# Altium project Desk-Clock-Timer.PrjPcb
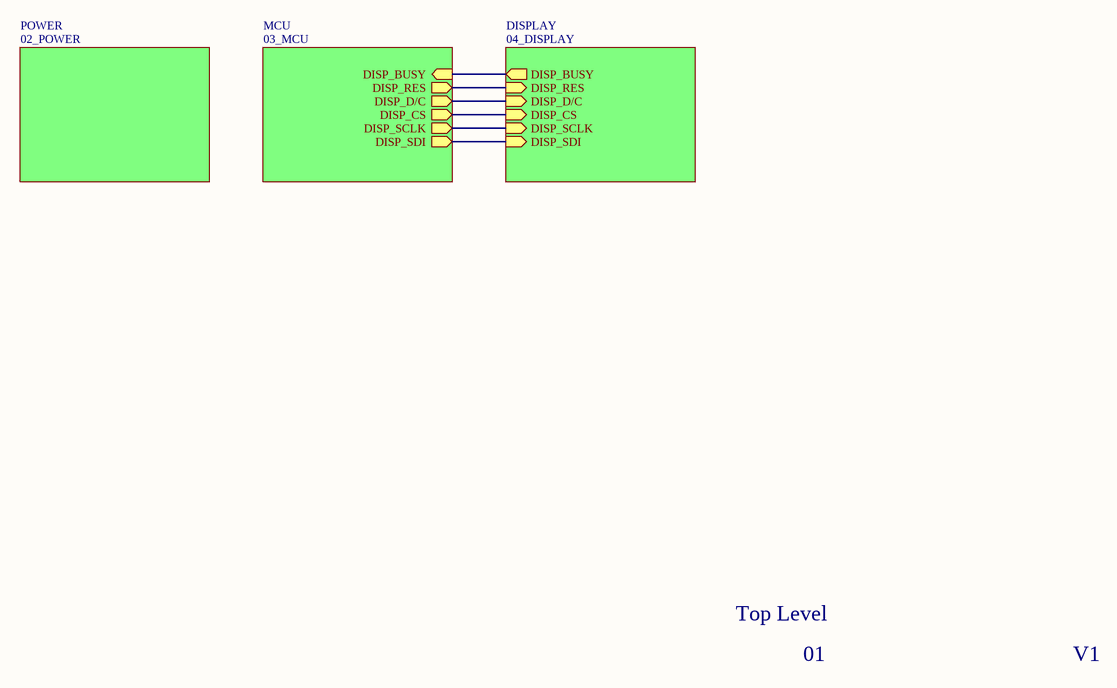
[diagram p0: 01_TOP_LEVEL.SchDoc]
4 sheets, 87 parts. Net scope: hierarchical (ports join the sheet entries above them; power ports are global).
Board file: PCB1.PcbDoc
Sheets:
  01_TOP_LEVEL.SchDoc
    POWER = 02_POWER.SchDoc
    MCU = 03_MCU.SchDoc
    DISPLAY = 04_DISPLAY.SchDoc

## Sheet 01_TOP_LEVEL.SchDoc
size A4; SheetNumber: 1; SheetTotal: 4

### Sub-sheets
DISPLAY = 04_DISPLAY: DISP_BUSY (out), DISP_RES (in), DISP_D/C (in), DISP_CS (in), DISP_SCLK (in), DISP_SDI (in)
MCU = 03_MCU: DISP_BUSY (in), DISP_RES (out), DISP_D/C (out), DISP_CS (out), DISP_SCLK (out), DISP_SDI (out)
POWER = 02_POWER: no entries

### Nets
NetIC300_13: sheet MCU/DISP_CS, sheet DISPLAY/DISP_CS
NetIC300_14: sheet MCU/DISP_SCLK, sheet DISPLAY/DISP_SCLK
NetIC300_15: sheet MCU/DISP_D/C, sheet DISPLAY/DISP_D/C
NetIC300_16: sheet MCU/DISP_SDI, sheet DISPLAY/DISP_SDI
NetIC300_17: sheet MCU/DISP_RES, sheet DISPLAY/DISP_RES
NetIC300_18: sheet MCU/DISP_BUSY, sheet DISPLAY/DISP_BUSY

### Notes on the sheet
- Top Level
- 01
- V1

## Sheet 02_POWER.SchDoc
size A4; SheetNumber: 2; SheetTotal: 4
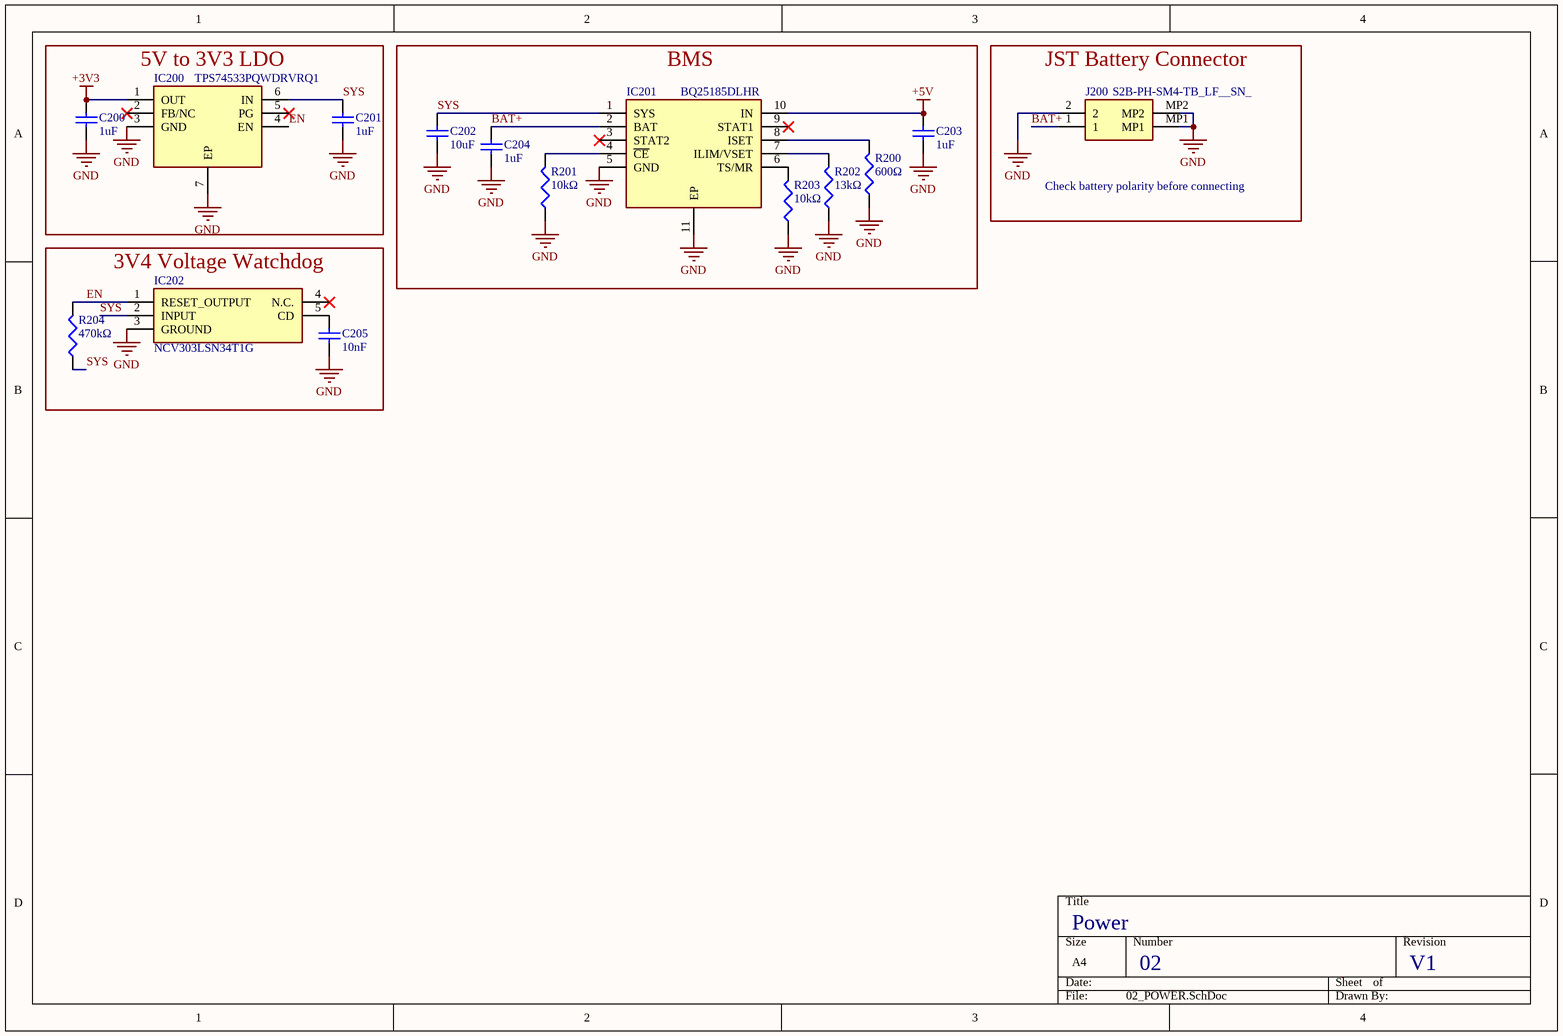
[diagram p1: 02_POWER.SchDoc]

### Parts
C200  value 1uF  [CAPC1005X55X25LL05T10]  (hidden comment: Capacitor 1 uF +/- 10% 6.3 V 0402)
C201  value 1uF  [CAPC1005X55X25LL05T10]  (hidden comment: Capacitor 1 uF +/- 10% 6.3 V 0402)
C202  value 10uF  [CAPC1005X55X25LL05T10]  (hidden comment: Capacitor 1 uF +/- 10% 6.3 V 0402)
C203  value 1uF  [CAPC1005X55X25LL05T10]  (hidden comment: Capacitor 1 uF +/- 10% 6.3 V 0402)
C204  value 1uF  [CAPC1005X55X25LL05T10]  (hidden comment: Capacitor 1 uF +/- 10% 6.3 V 0402)
C205  value 10nF  [CAPC1005X55X25LL05T10]  (hidden comment: Capacitor 1 uF +/- 10% 6.3 V 0402)
IC200  TPS74533PQWDRVRQ1  [SON65P200X200X80-7N]
IC201  BQ25185DLHR  [SON40P220X200X80-11N]
IC202  NCV303LSN34T1G  [SOT95P275X110-5N]
J200  S2B-PH-SM4-TB_LF__SN_  [S2BPHSM4TBLFSN]
R200  value 600Ω  [RESC0402(1005)_L]  (hidden comment: 100R2F)
R201  value 10kΩ  [RESC0402(1005)_L]  (hidden comment: 100R2F)
R202  value 13kΩ  [RESC0402(1005)_L]  (hidden comment: 100R2F)
R203  value 10kΩ  [RESC0402(1005)_L]  (hidden comment: 100R2F)
R204  value 470kΩ  [RESC0402(1005)_L]  (hidden comment: 100R2F)

### Blocks framed on the sheet
5V to 3V3 LDO: C200 C201 IC200
BMS: C202-C204 IC201 R200-R203
JST Battery Connector: J200
3V4 Voltage Watchdog: C205 IC202 R204

### Nets
+3V3: C200.2 IC200.1(OUT)
+5V: C203.2 IC201.10(IN)
GND: C200.1 C201.1 C202.1 C203.1 C204.1 C205.1 IC200.3(GND) IC200.7(EP) IC201.5(GND) IC201.11(EP) IC202.3(GROUND) J200.2 J200.MP1 J200.MP2 R200.1 R201.1 R202.1 R203.1
BAT+: C204.2 IC201.2(BAT) J200.1
EN: IC200.4(EN) IC202.1(RESET_OUTPUT) R204.2
SYS: C201.2 C202.2 IC200.6(IN) IC201.1(SYS) IC202.2(INPUT) R204.1
NetC205_2: C205.2 IC202.5(CD)
NetIC201_4: IC201.4(~{CE}) R201.2
NetIC201_6: IC201.6(TS/MR) R203.2
NetIC201_7: IC201.7(ILIM/VSET) R202.2
NetIC201_8: IC201.8(ISET) R200.2

Not connected (* = marked no-connect by the designer): IC200 2(FB/NC)* 5(PG)*; IC201 3(STAT2)* 9(STAT1)*; IC202 4(N.C.)*

### Notes on the sheet
- Check battery polarity before connecting
- Power
- 02
- V1

### Library data of the parts
C200-C205 = CMP-001-00008-6: Chip Capacitor, 1 uF, +/- 10%, 6.3 V, 0402 (1005 Metric); Capacitor Type: Ceramic; Voltage Rating: 6.3V; Max Operating Temperature: 85°C; Mounting Technology: SM; Tolerance: 10%; Case/Package: 0402; RoHS Compliant: True; Min Operating Temperature: -55°C; Pins: 2
IC200 = TPS74533PQWDRVRQ1: Integrated Circuit; Manufacturer_Name: Texas Instruments; Datasheet Link: https://www.ti.com/lit/gpn/TPS745-Q1; Height: 0.8mm; Manufacturer_Part_Number: TPS74533PQWDRVRQ1; Mouser Part Number: 595-PS74533PQWDRVRQ1; Mouser Price/Stock: https://www.mouser.co.uk/ProductDetail/Texas-Instruments/TPS74533PQWDRVRQ1?qs=%252B6g0mu59x7KMjoigNjBCww%3D%3D
IC201 = BQ25185DLHR: Integrated Circuit; Manufacturer_Name: Texas Instruments; Datasheet Link: https://www.ti.com/lit/ds/symlink/bq25185.pdf?ts=1706857561339&ref_url=https%253A%252F%252Fwww.ti.com%252Fproduct%252FBQ25185; Height: 0.8mm; Manufacturer_Part_Number: BQ25185DLHR; Mouser Part Number: 595-BQ25185DLHR; Mouser Price/Stock: https://www.mouser.co.uk/ProductDetail/Texas-Instruments/BQ25185DLHR?qs=Z%252BL2brAPG1IbO%2FV3RqsaPw%3D%3D
IC202 = NCV303LSN34T1G: Integrated Circuit; Manufacturer_Name: onsemi; Datasheet Link: https://www.onsemi.com/pub/Collateral/NCP302-D.PDF; Height: 1.1mm; Manufacturer_Part_Number: NCV303LSN34T1G; Mouser Part Number: 863-NCV303LSN34T1G; Mouser Price/Stock: https://www.mouser.com/Search/Refine.aspx?Keyword=863-NCV303LSN34T1G; Arrow Part Number: NCV303LSN34T1G; Arrow Price/Stock: https://www.arrow.com/en/products/ncv303lsn34t1g/on-semiconductor.html?utm_currency=USD&region=europe
J200 = S2B-PH-SM4-TB_LF__SN_: Connector; Manufacturer_Name: JST (JAPAN SOLDERLESS TERMINALS); Manufacturer_Part_Number: S2B-PH-SM4-TB(LF)(SN); Datasheet Link: https://www.jst-mfg.com/product/pdf/eng/ePH.pdf; Height: 6.6mm; Mouser Part Number: N/A; Mouser Price/Stock: https://www.mouser.co.uk/ProductDetail/JST-Commercial/S2B-PH-SM4-TBLFSN?qs=QpmGXVUTftEA9IU90i0xlg%3D%3D; Arrow Part Number: S2B-PH-SM4-TB(LF)(SN); Arrow Price/Stock: https://www.arrow.com/en/products/s2b-ph-sm4-tb-lf-sn/jst-manufacturing?utm_currency=USD&region=europe; ComponentLink1Description: DigiKey; ComponentLink1URL: https://www.digikey.ca/en/products/detail/jst-sales-america-inc/S2B-PH-SM4-TB/926655; ComponentLink2Description: Battery; ComponentLink2URL: https://www.amazon.ca/4200mah-Rechargeable-Lithium-Replacement-Electronic/dp/B091Y3TW9F?sr=8-6
R200-R204 = CMP-009-00065-2: 100R 0.063W 1% 0402 (1005 Metric)  SMD; Power: 63mW; Tolerance: 1%; Case/Package: 0402; Pins: 2; Mounting Technology: SMT

## Sheet 03_MCU.SchDoc
size A3; SheetNumber: 3; SheetTotal: 4
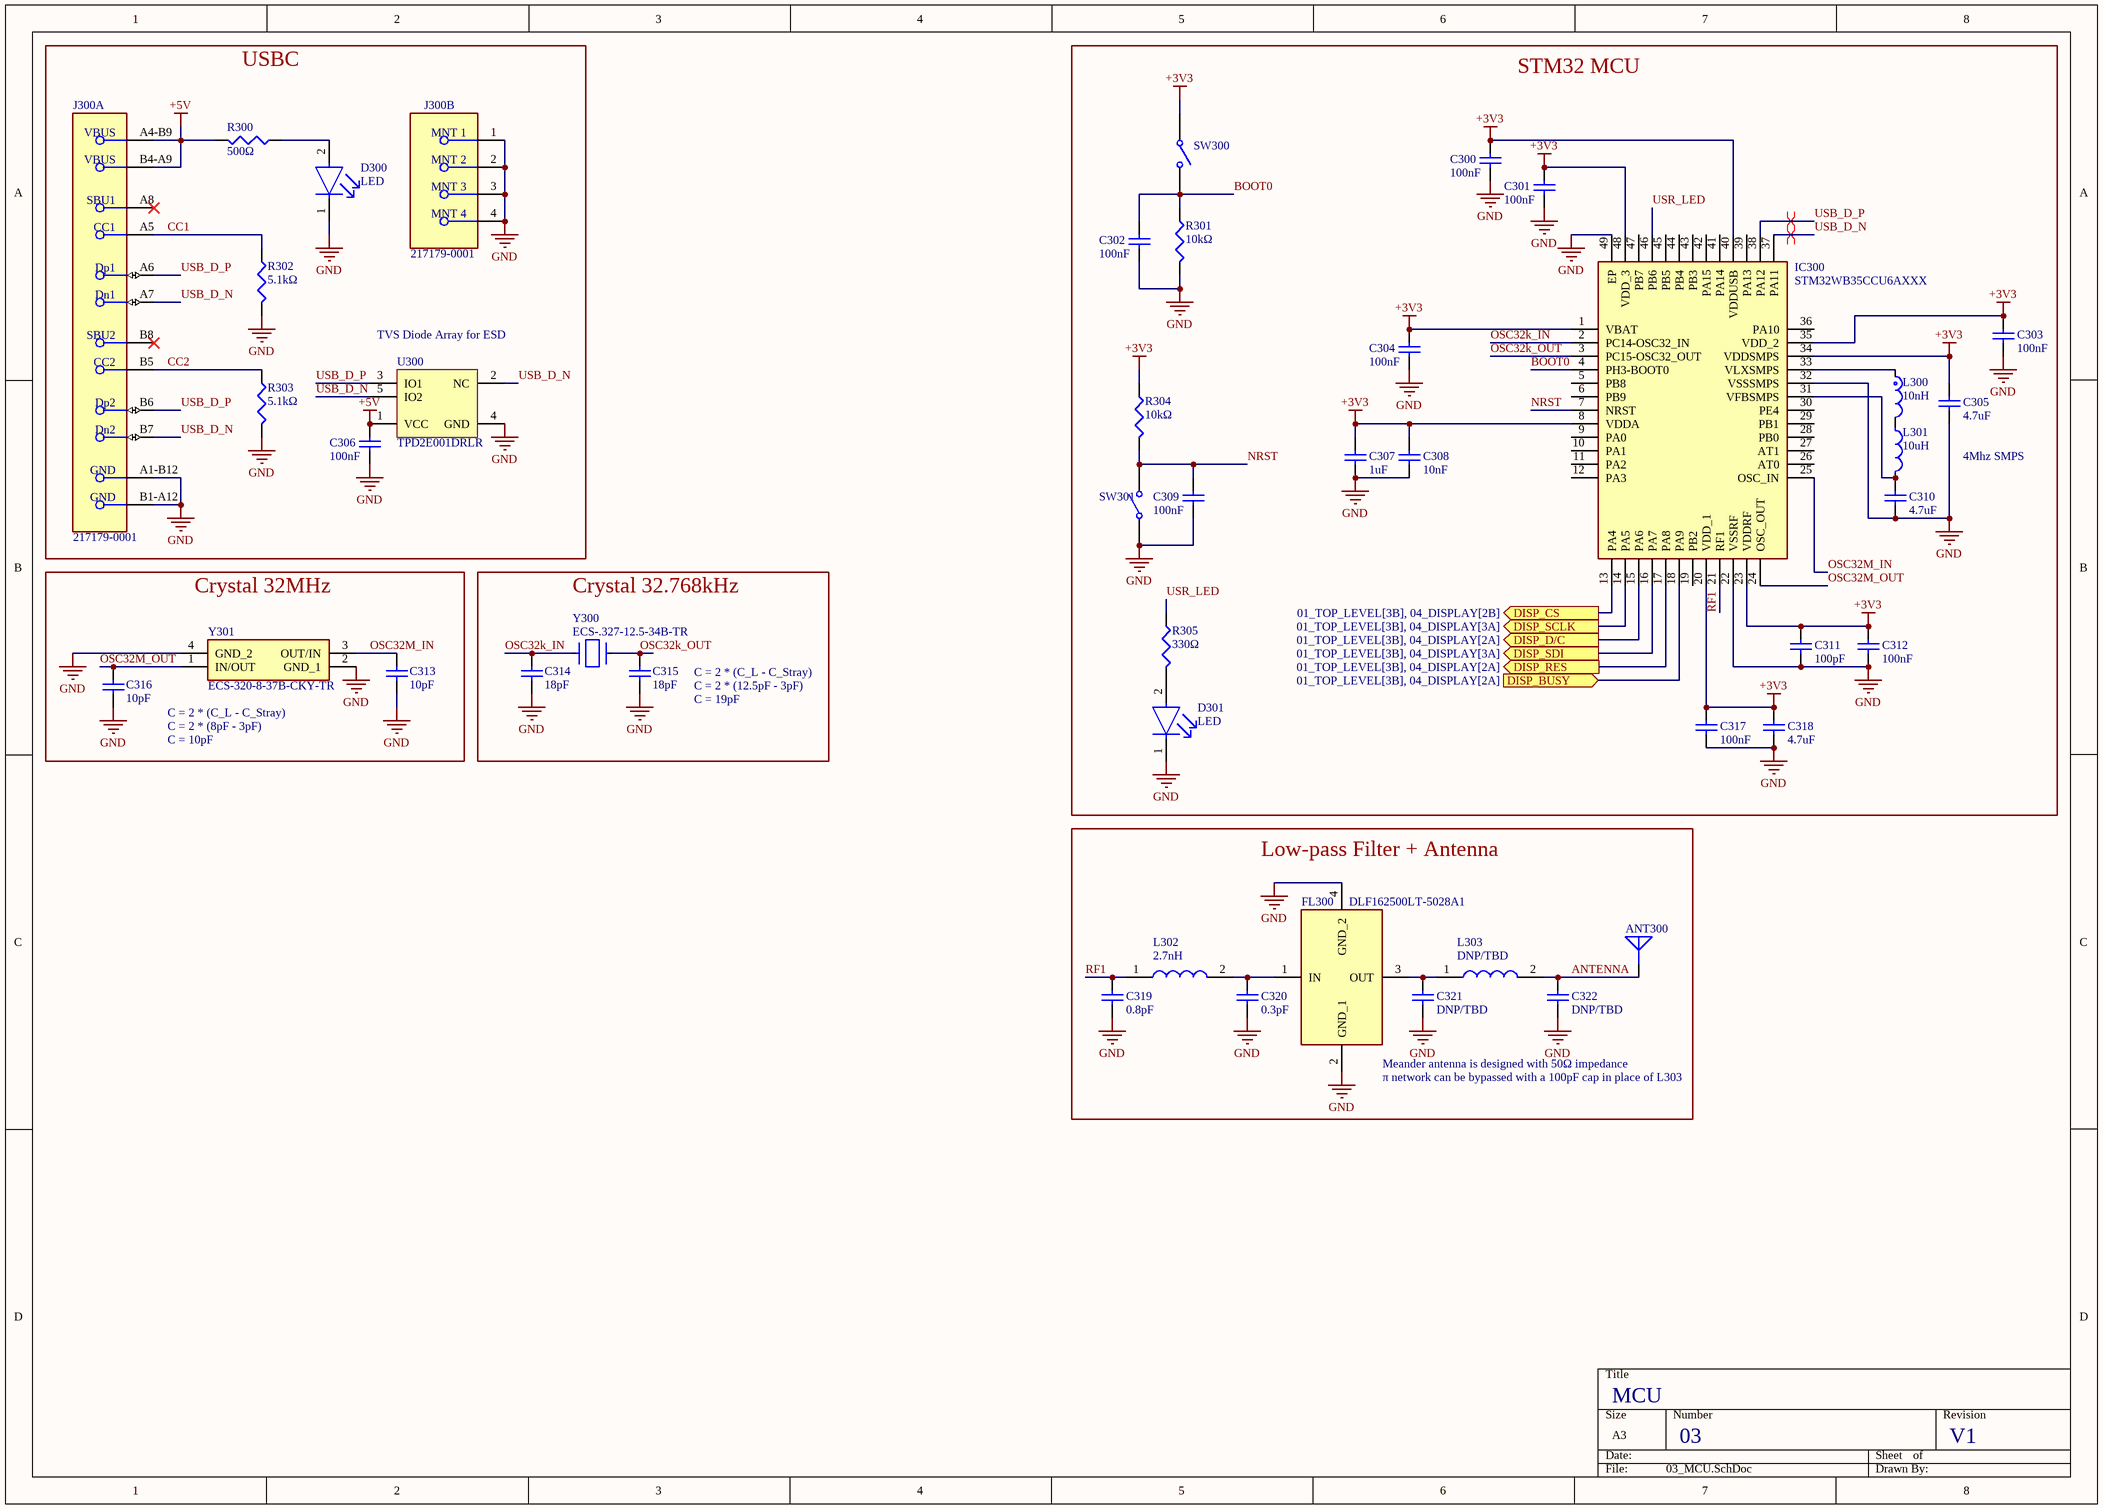
[diagram p2: 03_MCU.SchDoc]

### Parts
ANT300  MEANDER_ANTENNA  [MEANDER_ANTENNA]  (value not drawn)
C300  value 100nF  [CAPC1005X55X25LL05T10]  (hidden comment: Capacitor 1 uF +/- 10% 6.3 V 0402)
C301  value 100nF  [CAPC1005X55X25LL05T10]  (hidden comment: Capacitor 1 uF +/- 10% 6.3 V 0402)
C302  value 100nF  [CAPC1005X55X25LL05T10]  (hidden comment: Capacitor 1 uF +/- 10% 6.3 V 0402)
C303  value 100nF  [CAPC1005X55X25LL05T10]  (hidden comment: Capacitor 1 uF +/- 10% 6.3 V 0402)
C304  value 100nF  [CAPC1005X55X25LL05T10]  (hidden comment: Capacitor 1 uF +/- 10% 6.3 V 0402)
C305  value 4.7uF  [CAPC1005X55X25LL05T10]  (hidden comment: Capacitor 1 uF +/- 10% 6.3 V 0402)
C306  value 100nF  [CAPC1005X55X25LL05T10]  (hidden comment: Capacitor 1 uF +/- 10% 6.3 V 0402)
C307  value 1uF  [CAPC1005X55X25LL05T10]  (hidden comment: Capacitor 1 uF +/- 10% 6.3 V 0402)
C308  value 10nF  [CAPC1005X55X25LL05T10]  (hidden comment: Capacitor 1 uF +/- 10% 6.3 V 0402)
C309  value 100nF  [CAPC1005X55X25LL05T10]  (hidden comment: Capacitor 1 uF +/- 10% 6.3 V 0402)
C310  value 4.7uF  [CAPC1005X55X25LL05T10]  (hidden comment: Capacitor 1 uF +/- 10% 6.3 V 0402)
C311  value 100pF  [CAPC1005X55X25LL05T10]  (hidden comment: Capacitor 1 uF +/- 10% 6.3 V 0402)
C312  value 100nF  [CAPC1005X55X25LL05T10]  (hidden comment: Capacitor 1 uF +/- 10% 6.3 V 0402)
C313  value 10pF  [CAPC1005X55X25LL05T10]  (hidden comment: Capacitor 1 uF +/- 10% 6.3 V 0402)
C314  value 18pF  [CAPC1005X55X25LL05T10]  (hidden comment: Capacitor 1 uF +/- 10% 6.3 V 0402)
C315  value 18pF  [CAPC1005X55X25LL05T10]  (hidden comment: Capacitor 1 uF +/- 10% 6.3 V 0402)
C316  value 10pF  [CAPC1005X55X25LL05T10]  (hidden comment: Capacitor 1 uF +/- 10% 6.3 V 0402)
C317  value 100nF  [CAPC1005X55X25LL05T10]  (hidden comment: Capacitor 1 uF +/- 10% 6.3 V 0402)
C318  value 4.7uF  [CAPC1005X55X25LL05T10]  (hidden comment: Capacitor 1 uF +/- 10% 6.3 V 0402)
C319  value 0.8pF  [CAPC1005X55X25LL05T10]  (hidden comment: Capacitor 1 uF +/- 10% 6.3 V 0402)
C320  value 0.3pF  [CAPC1005X55X25LL05T10]  (hidden comment: Capacitor 1 uF +/- 10% 6.3 V 0402)
C321  value DNP/TBD  [CAPC1005X55X25LL05T10]  (hidden comment: Capacitor 1 uF +/- 10% 6.3 V 0402)
C322  value DNP/TBD  [CAPC1005X55X25LL05T10]  (hidden comment: Capacitor 1 uF +/- 10% 6.3 V 0402)
D300  LED  [FP-VLMO1500-GS08-MFG]
D301  LED  [FP-VLMO1500-GS08-MFG]
FL300  DLF162500LT-5028A1  [DLF162500LT5028A1]
IC300  STM32WB35CCU6AXXX  [QFN50P700X700X65-49N-D]
J300  217179-0001  [FP-2171790001-MFG]  (parts A,B of 2)
L300  10nH  [FP-LQG15WH_02-MFG]
L301  10uH  [FP-LQM21FN_70-MFG]
L302  2.7nH  [LQG15WH0N7B02D]
L303  DNP/TBD  [LQG15WH0N7B02D]
R300  value 500Ω  [RESC0402(1005)_L]  (hidden comment: 100R2F)
R301  value 10kΩ  [RESC0402(1005)_L]  (hidden comment: 100R2F)
R302  value 5.1kΩ  [RESC0402(1005)_L]  (hidden comment: 100R2F)
R303  value 5.1kΩ  [RESC0402(1005)_L]  (hidden comment: 100R2F)
R304  value 10kΩ  [RESC0402(1005)_L]  (hidden comment: 100R2F)
R305  value 330Ω  [RESC0402(1005)_L]  (hidden comment: 100R2F)
SW300  434111050826  [434111050826]  (value not drawn)
SW301  434111050826  [434111050826]  (value not drawn)
U300  TPD2E001DRLR  [DRL0005A_L]
Y300  ECS-.327-12.5-34B-TR  [FP-ECX-31B-MFG]
Y301  ECS-320-8-37B-CKY-TR  [ECS320837BCKYTR]

### Blocks framed on the sheet
USBC: C306 D300 J300 R300 R302 R303 U300
STM32 MCU: C300-C305 C307-C312 C317 C318 D301 IC300 L300 L301 R301 R304 R305 SW300 SW301
Crystal 32MHz: C313 C316 Y301
Crystal 32.768kHz: C314 C315 Y300
Low-pass Filter + Antenna: ANT300 C319-C322 FL300 L302 L303

### Ports
DISP_BUSY (in, see 01_TOP_LEVEL[3B], 04_DISPLAY[2A]), DISP_CS (out, see 01_TOP_LEVEL[3B], 04_DISPLAY[2B]), DISP_D/C (out, see 01_TOP_LEVEL[3B], 04_DISPLAY[2A]), DISP_RES (out, see 01_TOP_LEVEL[3B], 04_DISPLAY[2A]), DISP_SCLK (out, see 01_TOP_LEVEL[3B], 04_DISPLAY[3A]), DISP_SDI (out, see 01_TOP_LEVEL[3B], 04_DISPLAY[3A])

### Nets
+3V3: C300.2 C301.2 C303.2 C304.2 C305.2 C307.2 C308.2 C311.2 C312.2 C317.2 C318.2 IC300.1(VBAT) IC300.8(VDDA) IC300.20(VDD_1) IC300.23(VDDRF) IC300.34(VDDSMPS) IC300.35(VDD_2) IC300.40(VDDUSB) IC300.48(VDD_3) R304.1 SW300.1
+5V: C306.2 J300.A4-B9(VBUS) J300.B4-A9(VBUS) R300.2 U300.1(VCC)
GND: C300.1 C301.1 C302.1 C303.1 C304.1 C305.1 C306.1 C307.1 C308.1 C309.1 C310.1 C311.1 C312.1 C313.1 C314.1 C315.1 C316.1 C317.1 C318.1 C319.1 C320.1 C321.1 C322.1 D300.1(C) D301.1(C) FL300.2(GND_1) FL300.4(GND_2) IC300.22(VSSRF) IC300.32(VSSSMPS) IC300.49(EP) J300.1(MNT_1) J300.2(MNT_2) J300.3(MNT_3) J300.4(MNT_4) J300.A1-B12(GND) J300.B1-A12(GND) R301.2 R302.2 R303.2 SW301.1 U300.4(GND) Y301.2(GND_1) Y301.4(GND_2)
ANTENNA: ANT300.0 C322.2 L303.2
BOOT0: C302.2 IC300.4(PH3-BOOT0) R301.1 SW300.2
CC1: J300.A5(CC1) R302.1
CC2: J300.B5(CC2) R303.1
NRST: C309.2 IC300.7(NRST) R304.2 SW301.2
OSC32k_IN: C314.2 IC300.2(PC14-OSC32_IN) Y300.1(In/Out)
OSC32k_OUT: C315.2 IC300.3(PC15-OSC32_OUT) Y300.2(Out/In)
OSC32M_IN: C313.2 IC300.25(OSC_IN) Y301.3(OUT/IN)
OSC32M_OUT: C316.2 IC300.24(OSC_OUT) Y301.1(IN/OUT)
RF1: C319.2 IC300.21(RF1) L302.1
USB_D_N: IC300.37(PA11) J300.A7(Dn1) J300.B7(Dn2) U300.2(NC) U300.5(IO2)
USB_D_P: IC300.38(PA12) J300.A6(Dp1) J300.B6(Dp2) U300.3(IO1)
USR_LED: IC300.46(PB6) R305.1
NetC310_2: C310.2 IC300.31(VFBSMPS) L301.2
NetC320_2: C320.2 FL300.1(IN) L302.2
NetC321_2: C321.2 FL300.3(OUT) L303.1
NetD300_2: D300.2(A) R300.1
NetD301_2: D301.2(A) R305.2
NetIC300_13: IC300.13(PA4) ; port DISP_CS
NetIC300_14: IC300.14(PA5) ; port DISP_SCLK
NetIC300_15: IC300.15(PA6) ; port DISP_D/C
NetIC300_16: IC300.16(PA7) ; port DISP_SDI
NetIC300_17: IC300.17(PA8) ; port DISP_RES
NetIC300_18: IC300.18(PA9) ; port DISP_BUSY
NetIC300_33: IC300.33(VLXSMPS) L300.1
NetL300_2: L300.2 L301.1

Not connected (* = marked no-connect by the designer): IC300 5(PB8) 6(PB9) 9(PA0) 10(PA1) 11(PA2) 12(PA3) 19(PB2) 26(AT0) 27(AT1) 28(PB0) 29(PB1) 30(PE4) 36(PA10) 39(PA13) 41(PA14) 42(PA15) 43(PB3) 44(PB4) 45(PB5) 47(PB7); J300 A8(SBU1)* B8(SBU2)*

### Layout directives
differential pair: USB_D_N, USB_D_P

### Notes on the sheet
- (near U300) TVS Diode Array for ESD
- 4Mhz SMPS
- C = 2 * (C_L - C_Stray)
- C = 2 * (12.5pF - 3pF)
- C = 19pF
- C = 2 * (8pF - 3pF)
- C = 10pF
- (near FL300) Meander antenna is designed with 50Ω impedance
- (near FL300) π network can be bypassed with a 100pF cap in place of L303
- MCU
- 03
- V1

### Library data of the parts
ANT300 = MEANDER_ANTENNA: 2.4GHz meander antenna; ComponentLink1Description: ST Guidelines; ComponentLink1URL: https://www.st.com/resource/en/application_note/an5129-guidelines-for-meander-design-using-lowcost-pcb-antennae-with-24-ghz-radio-for-stm32wbwb0-mcus-stmicroelectronics.pdf
C300-C322 = CMP-001-00008-6: as C200 on sheet 02_POWER; Max Operating Temperature: 85°C; Mounting Technology: SM; Tolerance: 10%; Case/Package: 0402; RoHS Compliant: True; Min Operating Temperature: -55°C; Pins: 2
D300 D301 = CMP-00030-24098164-1: VLMO1500-GS08 LED Uni-Color Soft Orange 611nm 2-Pin Chip 0402(1006Metric) T/R; Luminous Intensity: 90mcd; Dominant Wavelength: 605nm; Forward Voltage: 2V; Test Current: 20mA; Lens Style: Rectangular, Square; Reverse Voltage: 5V; Power Rating: 75mW; Viewing Angle: 130°; Number of LEDs: 1; NexarPartId: 24098164; Ambient Temperature Range High: 85°C; Wavelength: 605nm; Schedule B: 8541402000, 8541402000; Number of Pins: 2; Length: 1mm; Width: 500µm; Illumination Color: Orange; Case/Package: 0402; RoHS: Compliant; Packaging: Cut Tape; Radiation Hardening: No; Case Code (Imperial): 0402; Lead Free: Lead Free; Case Code (Metric): 1005; Forward Current: 20mA; Color: Orange; Min Operating Temperature: -30°C; Height: 350µm; Max Operating Temperature: 85°C; Mount: Surface Mount; Power Dissipation: 75mW
FL300 = DLF162500LT-5028A1: Filter; Manufacturer_Name: TDK; Datasheet Link: https://product.tdk.com/system/files/dam/doc/product/rf/rf/filter/catalog/rf_lpf_dlf162500lt-5028a1_en.pdf; Height: 0.4mm; Manufacturer_Part_Number: DLF162500LT-5028A1; Mouser Part Number: 810-DLF16250LT5028A1; Mouser Price/Stock: https://www.mouser.co.uk/ProductDetail/TDK/DLF162500LT-5028A1?qs=U%2FZX79kHR%2FlwIbAISCs3qA%3D%3D; Arrow Part Number: DLF162500LT-5028A1; Arrow Price/Stock: https://www.arrow.com/en/products/dlf162500lt-5028a1/tdk?utm_currency=USD&region=nac
IC300 = STM32WB35CCU6AXXX: Integrated Circuit; Manufacturer_Name: STMicroelectronics; Datasheet Link: https://www.st.com/resource/en/datasheet/stm32wb35cc.pdf; Height: 0.65mm; Manufacturer_Part_Number: STM32WB35CCU6AXXX; ComponentLink1Description: DigiKey; ComponentLink1URL: https://www.digikey.ca/en/products/detail/stmicroelectronics/STM32WB35CCU6A/13282469
J300 = CMP-04767-000028-2: CONN RCP USB2.0 TYP C 24P SMD RA; NexarPartId: 117190526; Gender: Receptacle; Number of Contacts: 16; Current Rating: 1.25A; Voltage Rating: 30V; Min Operating Temperature: -40°C; USB Standard: USB 2.0; Height: 3.36mm; Contact Material: Gold, Nickel; Max Operating Temperature: 85°C
L300 = CMP-06042-005237-1: Multilayer type Inductor for Automotive 10nH ±5% 0.19Ω 500mA 0402; Core Material: Air; Test Frequency: 100MHz; DC Resistance (DCR): 190mR; Shielding: Unshielded; Self Resonant Frequency: 3.3GHz; Min Operating Temperature: -55°C; Tolerance: 5%; Inductance: 10nH; Max Operating Temperature: 125°C; Packaging: Cut Tape; Current Rating: 500mA; Case Code (Metric): 1005; Mount: Surface Mount; Case/Package: 0402; Ratings: AEC-Q200; Case Code (Imperial): 0402
L301 = CMP-2000-06587-2: FIXED IND 10UH 100MA 780MOHM SMD; Shielding: Shielded; Core Material: Ferrite; Self Resonant Frequency: 15MHz; Tolerance: 20%; DC Resistance (DCR): 780mR; Test Frequency: 1MHz; Height: 1.45mm; Package Quantity: 3000; Width: 0.049inch; Inductance: 10uH; Saturation Current: 100mA; Termination: SMD/SMT; Case Code (Metric): 2012; Case/Package: 0805; RoHS Compliant: Yes; Series: LQM21F_70; Max Operating Temperature: 125°C; Lead Free: Lead Free; DC Current: 100mA; Length: 2.2mm; Radiation Hardening: No; Max DC Current: 100mA; Case Code (Imperial): 0805; Packaging: Tape and Reel; Height - Seated (Max): 0.057inch; Rated Current-Max: 100mA; Military Standard: Not; Mount: Surface Mount; Min Operating Temperature: -55°C; Depth: 1.45mm; Current Rating: 100mA
L302 L303 = LQG15HS2N7S02D: Inductor; Manufacturer_Name: Murata Electronics; Datasheet Link: https://search.murata.co.jp/Ceramy/image/img/P02/JELF243B-0010.pdf; Height: 0.6mm; Manufacturer_Part_Number: LQG15HS2N7S02D; Mouser Part Number: 81-LQG15HS2N7S02D; Mouser Price/Stock: https://www.mouser.co.uk/ProductDetail/Murata-Electronics/LQG15HS2N7S02D?qs=ctz47l0uL1AKrLI74yO5Qw%3D%3D; Arrow Part Number: LQG15HS2N7S02D; Arrow Price/Stock: https://www.arrow.com/en/products/lqg15hs2n7s02d/murata-manufacturing?utm_currency=USD&region=nac
R300-R305 = CMP-009-00065-2: as R200 on sheet 02_POWER; Tolerance: 1%; Case/Package: 0402; Pins: 2; Mounting Technology: SMT
SW300 SW301 = CMP-1459-00003-6: Switch Tactile Spst-no 0.05A 12V; Manufacturer Lifecycle Status: ACTIVE; Actuator Length: 1.5mm; Current Rating: 50mA; Switch Travel: 250µm; Actuator Material: Liquid Crystal Polymer, Polymer; Contact Resistance: 100mΩ; Mechanical Life: 30kcycles; Operating Force: 260N; Illumination Type: Illuminated, Non-Illuminated; Switch Function: Off-Mom; YEOL: 1 = Estimated lifetime > 10 years; Throw Configuration: SPST; Termination: SMD/SMT; Contact Material: Stainless Steel, Steel; Min Operating Temperature: -40°C; Lifecycle Status: Production; Contact Plating: Silver; Contact Current Rating: 50mA; Packaging: Tape and Reel; Length: 8mm; RoHS: Compliant; REACH SVHC: No; Max Operating Temperature: 85°C; Height: 5mm; Insulation Resistance: 100MΩ; Voltage Rating: 12V; Mount: Surface Mount
U300 = CMP-0326-00048-3: Low-Capacitance + / - 15 kV ESD-Protection Array for High-Speed Data Interfaces, 2 Channels, -40 to +85 degC, 5-pin SOT (DRL), Green (RoHS & no Sb/Br); Manufacturer: Texas Instruments; IO Leakage Current(nA): 1; IEC 61000-4-2 Air-Gap(+/- kV): 15; IEC 61000-4-2 Contact(+/- kV): 8; SubFamily: ESD Solution; IO Capacitance(Typ)(pF): 1.5; Breakdown Voltage(Min)(V): 11; USB High Speed: TRUE; ComponentLink3Description: URL Link1; PackageReference: DRL0005A; PartNumber: TPD2E001DRLR; PackageDescription: 5-Pin Plastic Small Outline, Flat Lead 0.5 mm Pitch; PackageVersion: revD, Aug-2007; DatasheetVersion: SLLS684F; ComponentLink1Description: Manufacturer URL; ComponentLink2Description: Datasheet; ComponentLink1URL: http://www.ti.com/; ComponentLink2URL: http://www.ti.com/general/docs/lit/getliterature.tsp?genericPartNumber=TPD2E001&fileType=pdf; ComponentLink3URL: SamplesURL:http://www.ti.com/product/tpd2e001#samples; Eco-Plan: Green (RoHS & no Sb/Br); Mounting Technology: Surface Mount
Y300 = CMP-40224-000020-1: CRYSTAL 32.7680KHZ 12.5PF SMD; Frequency Tolerance: 20ppm; Frequency: 32.768kHz; ESR (Equivalent Series Resistance): 70kR; Max Operating Temperature: 85°C; Height: 0.035inch; Number of Pins: 2; Width: 0.059inch; Package Quantity: 3000; Length: 0.126inch; Min Operating Temperature: -40°C; Load Capacitance: 12.5pF; Mount: Surface Mount; Case/Package: SMD/SMT; Termination: SMD/SMT; Packaging: Tape and Reel
Y301 = ECS-320-8-37B-CKY-TR: Crystal or Oscillator; Manufacturer_Name: ECS; Datasheet Link: https://ecsxtal.com/store/pdf/ECX-1637B.pdf; Height: 0.5mm; Manufacturer_Part_Number: ECS-320-8-37B-CKY-TR; Mouser Part Number: 520-320-8-37B-CKYT; Mouser Price/Stock: https://www.mouser.co.uk/ProductDetail/ECS/ECS-320-8-37B-CKY-TR?qs=l7cgNqFNU1jF5E15eCxZkA%3D%3D; Arrow Part Number: ECS-320-8-37B-CKY-TR; Arrow Price/Stock: https://www.arrow.com/en/products/ecs-320-8-37b-cky-tr/ecs-international?region=nac

## Sheet 04_DISPLAY.SchDoc
size A4; SheetNumber: 4; SheetTotal: 4
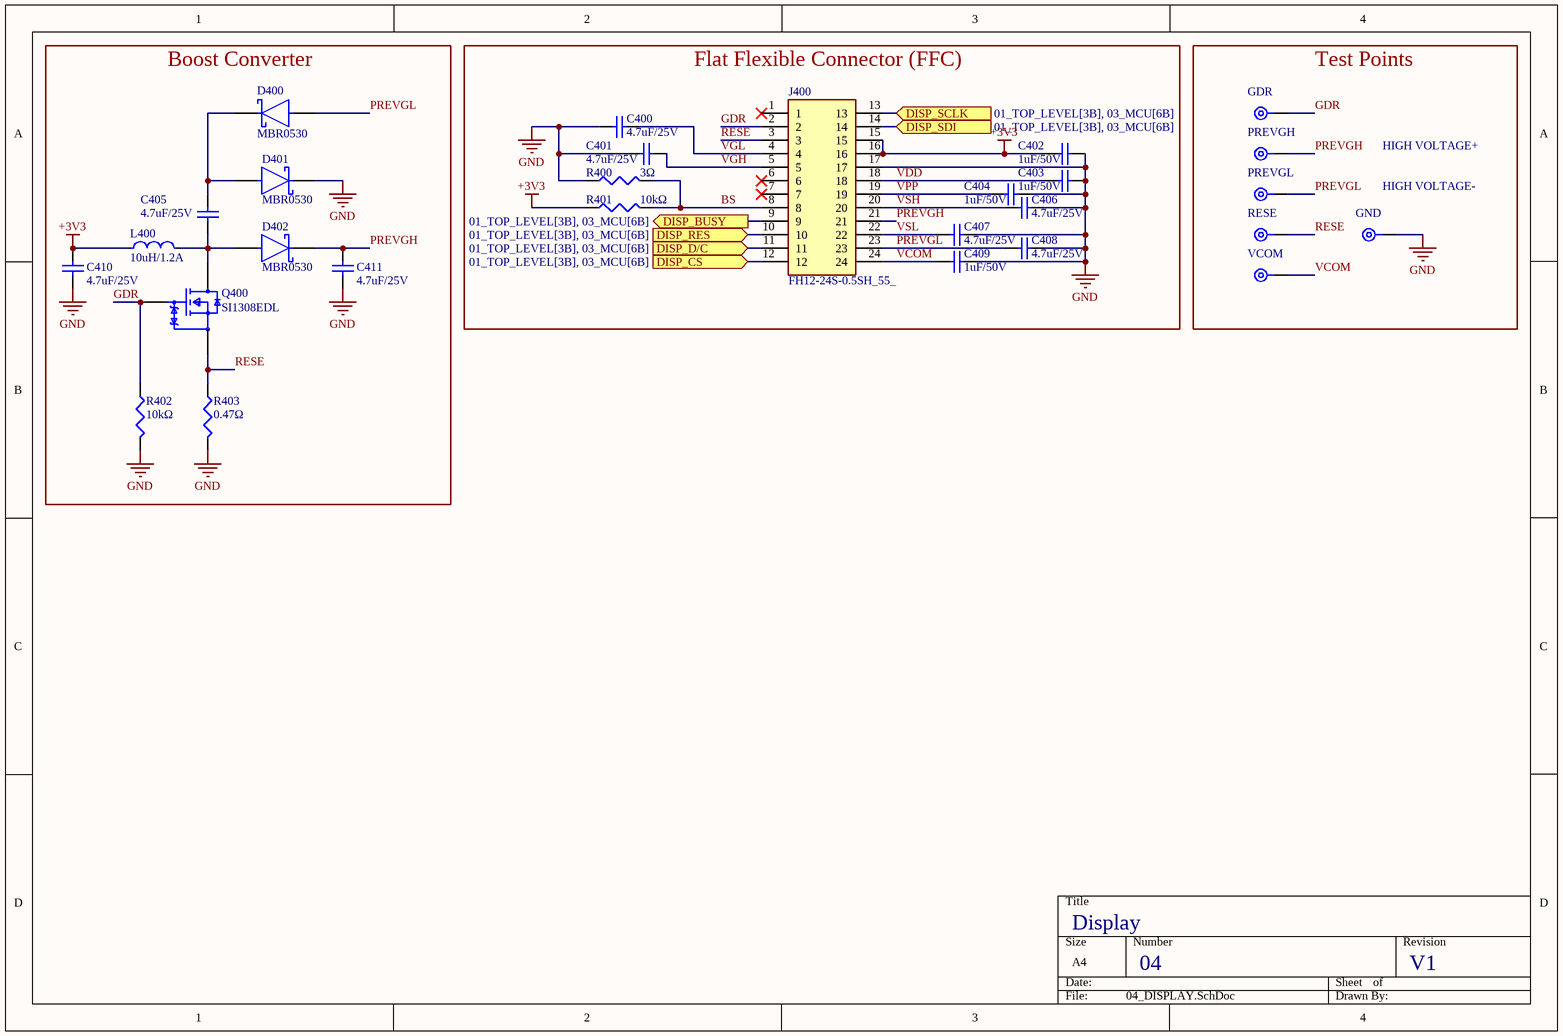
[diagram p3: 04_DISPLAY.SchDoc]

### Parts
C400  value 4.7uF/25V  [CAPC1005X55X25LL05T10]  (hidden comment: Capacitor 1 uF +/- 10% 6.3 V 0402)
C401  value 4.7uF/25V  [CAPC1005X55X25LL05T10]  (hidden comment: Capacitor 1 uF +/- 10% 6.3 V 0402)
C402  value 1uF/50V  [CAPC1005X55X25LL05T10]  (hidden comment: Capacitor 1 uF +/- 10% 6.3 V 0402)
C403  value 1uF/50V  [CAPC1005X55X25LL05T10]  (hidden comment: Capacitor 1 uF +/- 10% 6.3 V 0402)
C404  value 1uF/50V  [CAPC1005X55X25LL05T10]  (hidden comment: Capacitor 1 uF +/- 10% 6.3 V 0402)
C405  value 4.7uF/25V  [CAPC1005X55X25LL05T10]  (hidden comment: Capacitor 1 uF +/- 10% 6.3 V 0402)
C406  value 4.7uF/25V  [CAPC1005X55X25LL05T10]  (hidden comment: Capacitor 1 uF +/- 10% 6.3 V 0402)
C407  value 4.7uF/25V  [CAPC1005X55X25LL05T10]  (hidden comment: Capacitor 1 uF +/- 10% 6.3 V 0402)
C408  value 4.7uF/25V  [CAPC1005X55X25LL05T10]  (hidden comment: Capacitor 1 uF +/- 10% 6.3 V 0402)
C409  value 1uF/50V  [CAPC1005X55X25LL05T10]  (hidden comment: Capacitor 1 uF +/- 10% 6.3 V 0402)
C410  value 4.7uF/25V  [CAPC1005X55X25LL05T10]  (hidden comment: Capacitor 1 uF +/- 10% 6.3 V 0402)
C411  value 4.7uF/25V  [CAPC1005X55X25LL05T10]  (hidden comment: Capacitor 1 uF +/- 10% 6.3 V 0402)
D400  MBR0530  [FP-425-04-MFG]
D401  MBR0530  [FP-425-04-MFG]
D402  MBR0530  [FP-425-04-MFG]
GDR  TPAD10R  [TEST_POINT]  (value not drawn)
GND  TPAD10R  [TEST_POINT]  (value not drawn)
J400  FH12-24S-0.5SH_55_  [FH12-24S-0.5SH(55)]
L400  10uH/1.2A  [FP-LQH5BPB_T0-MFG]
PREVGH  TPAD10R  [TEST_POINT]  (value not drawn)
PREVGL  TPAD10R  [TEST_POINT]  (value not drawn)
Q400  SI1308EDL  [FP-5549-MFG]
R400  value 3Ω  [RESC0402(1005)_L]  (hidden comment: 100R2F)
R401  value 10kΩ  [RESC0402(1005)_L]  (hidden comment: 100R2F)
R402  value 10kΩ  [RESC0402(1005)_L]  (hidden comment: 100R2F)
R403  value 0.47Ω  [RESC0402(1005)_L]  (hidden comment: 100R2F)
RESE  TPAD10R  [TEST_POINT]  (value not drawn)
VCOM  TPAD10R  [TEST_POINT]  (value not drawn)

### Blocks framed on the sheet
Boost Converter: C405 C410 C411 D400-D402 L400 Q400 R402 R403
Flat Flexible Connector (FFC): C400-C404 C406-C409 J400 R400 R401
Test Points: GDR GND PREVGH PREVGL RESE VCOM

### Ports
DISP_BUSY (out, see 01_TOP_LEVEL[3B], 03_MCU[6B]), DISP_CS (in, see 01_TOP_LEVEL[3B], 03_MCU[6B]), DISP_D/C (in, see 01_TOP_LEVEL[3B], 03_MCU[6B]), DISP_RES (in, see 01_TOP_LEVEL[3B], 03_MCU[6B]), DISP_SCLK (in, see 01_TOP_LEVEL[3B], 03_MCU[6B]), DISP_SDI (in, see 01_TOP_LEVEL[3B], 03_MCU[6B])

### Nets
+3V3: C402.2 C410.2 J400.15 J400.16 L400.1 R401.1
GND: C400.2 C401.2 C402.1 C403.1 C404.1 C406.1 C407.1 C408.1 C409.1 C410.1 C411.1 D401.1(C) GND.1 J400.17 R400.1 R402.2 R403.2
BS: J400.8 R400.2 R401.2
GDR: GDR.1 J400.2 Q400.1(G) R402.1
PREVGH: C411.2 D402.1(C) J400.21 PREVGH.1
PREVGL: C408.2 D400.2(A) J400.23 PREVGL.1
RESE: J400.3 Q400.2(S) R403.1 RESE.1
VCOM: C409.2 J400.24 VCOM.1
VDD: C403.2 J400.18
VGH: C401.1 J400.5
VGL: C400.1 J400.4
VPP: C404.2 J400.19
VSH: C406.2 J400.20
VSL: C407.2 J400.22
NetC405_1: C405.1 D402.2(A) L400.2 Q400.3(D)
NetC405_2: C405.2 D400.1(C) D401.2(A)
NetIC300_13: J400.12 ; port DISP_CS
NetIC300_14: J400.13 ; port DISP_SCLK
NetIC300_15: J400.11 ; port DISP_D/C
NetIC300_16: J400.14 ; port DISP_SDI
NetIC300_17: J400.10 ; port DISP_RES
NetIC300_18: J400.9 ; port DISP_BUSY

Not connected (* = marked no-connect by the designer): J400 1* 6* 7*

### Notes on the sheet
- HIGH VOLTAGE+
- (near GND) HIGH VOLTAGE-
- Display
- 04
- V1

### Library data of the parts
C400-C411 = CMP-001-00008-6: as C200 on sheet 02_POWER; Max Operating Temperature: 85°C; Mounting Technology: SM; Tolerance: 10%; Case/Package: 0402; RoHS Compliant: True; Min Operating Temperature: -55°C; Pins: 2
D400-D402 = CMP-2000-05113-2: DIODE SCHOTTKY 30V 500MA SOD123; Polarity: Standard; Max Reverse Leakage Current: 130uA; Forward Voltage: 430mV; Element Configuration: Single; Peak Non-Repetitive Surge Current: 5.5A; REACH SVHC: No SVHC; Contact Plating: Tin; Width: 1.6mm; Weight: 0.03g; Max Reverse Voltage (DC): 30V; Mount: Surface Mount; Max Repetitive Reverse Voltage (Vrrm): 30V; Number of Pins: 2; Height: 1.03mm; Current Rating: 500mA; Max Forward Surge Current (Ifsm): 5.5A; Lead Free: Lead Free; Max Surge Current: 5.5A; Peak Reverse Current: 130uA; Min Operating Temperature: -65°C; Radiation Hardening: No; Max Operating Temperature: 150°C; Average Rectified Current: 500mA; Packaging: Tape and Reel; Length: 2.7mm; Forward Current: 500mA; Voltage Rating (DC): 30V; Package Quantity: 1; Output Current: 500mA; ComponentLink1Description: DigiKey; ComponentLink1URL: https://www.digikey.ca/en/products/detail/smc-diode-solutions/MBR0530/16692306
GDR GND PREVGH PREVGL RESE VCOM = TEST_POINT: Testpont Pad 10R
J400 = FH12-24S-0.5SH_55_: Connector; Manufacturer_Name: Hirose; Datasheet Link: https://datasheet.datasheetarchive.com/originals/distributors/SFDatasheet-1/sf-00023459.pdf; Manufacturer_Part_Number: FH12-24S-0.5SH(55); Mouser Part Number: 798-FH12-24S-0.5SH55; Mouser Price/Stock: https://www.mouser.co.uk/ProductDetail/Hirose-Connector/FH12-24S-0.5SH55?qs=Ux3WWAnHpjDGmuhYLgxkoQ%3D%3D; Arrow Part Number: FH12-24S-0.5SH(55); Arrow Price/Stock: https://www.arrow.com/en/products/fh12-24s-0-5sh-55/hirose-electric.html?utm_currency=USD&region=asia
L400 = CMP-06042-011567-1: Wire Wound Ferrite Inductor for Power Lines 10μH ±20% 0.1272Ω 1.60A 2020; Current Rating: 1.6A; Inductance: 10uH; Max DC Current: 2A; Test Frequency: 100kHz; Self Resonant Frequency: 25MHz; Shielding: Shielded; DC Resistance (DCR): 106mR; Core Material: Ferrite; Tolerance: 20%; Height - Seated (Max): 0.086inch; Inductance Tolerance: 20%; Lead Free: Lead Free; Depth: 5.2mm; Length: 5mm; Height: 2mm; Width: 5mm; Mount: Surface Mount; DC Current: 1.6A; Termination: SMD/SMT; REACH SVHC: No SVHC; Resistor Type: Wirewound; Package Quantity: 1; Case/Package: 2020; Max Operating Temperature: 125°C; Case Code (Imperial): 2220; Case Code (Metric): 5650; Packaging: Tape and Reel; Min Operating Temperature: -40°C; Military Standard: Not; ComponentLink1Description: DigiKey; ComponentLink1URL: https://www.digikey.ca/en/products/detail/murata-electronics/LQH5BPN100MT0L/4358089https://www.digikey.ca/en/products/detail/murata-electronics/LQH5BPN100MT0L/4358089
Q400 = CMP-02550-000099-2: MOSFET N-CH 30V 1.4A SC-70-3; Fall Time: 8ns; Max Power Dissipation: 500mW; Rise Time: 9ns; Rds On Max: 132mR; Power Dissipation: 400mW; Polarity: N-CHANNEL; Number of Elements: 1; Element Configuration: Single; Threshold Voltage: 600mV; Continuous Drain Current (ID): 1.5A; Gate to Source Voltage (Vgs): 12V; Turn-On Delay Time: 2ns; Input Capacitance: 105pF; Package Quantity: 3000; REACH SVHC: No SVHC; Mount: Surface Mount; Packaging: Tape and Reel; On-State Resistance: 132mR; Drain-source On Resistance-Max: 132mR; Lead Free: Lead Free; Drain to Source Breakdown Voltage: 30V; Series: TrenchFET®; Max Operating Temperature: 150°C; Drain to Source Resistance: 132mR; Radiation Hardening: No; Length: 2.2mm; Min Operating Temperature: -55°C; Number of Channels: 1; Drain to Source Voltage (Vdss): 30V; Number of Pins: 3; Turn-Off Delay Time: 8ns; Weight: 0.004395oz; RoHS Compliant: Yes; Width: 1.35mm; Height: 1mm; Case/Package: SOT-323; ComponentLink1Description: DigiKey; ComponentLink1URL: https://www.digikey.ca/en/products/detail/evvo/SI1308EDL-EV/26221122
R400-R403 = CMP-009-00065-2: as R200 on sheet 02_POWER; Tolerance: 1%; Case/Package: 0402; Pins: 2; Mounting Technology: SMT

## Nets that join several sheets
+3V3: 02_POWER (C200.2 IC200.1), 03_MCU (21 pins), 04_DISPLAY (6 pins)
+5V: 02_POWER (C203.2 IC201.10), 03_MCU (5 pins)
GND: 02_POWER (18 pins), 03_MCU (43 pins), 04_DISPLAY (17 pins)
NetIC300_13: 03_MCU (IC300.13), 04_DISPLAY (J400.12)
NetIC300_14: 03_MCU (IC300.14), 04_DISPLAY (J400.13)
NetIC300_15: 03_MCU (IC300.15), 04_DISPLAY (J400.11)
NetIC300_16: 03_MCU (IC300.16), 04_DISPLAY (J400.14)
NetIC300_17: 03_MCU (IC300.17), 04_DISPLAY (J400.10)
NetIC300_18: 03_MCU (IC300.18), 04_DISPLAY (J400.9)